# EAGLE design ir-sensor-breakout-mk-2.1 (EAGLE 6.5.0)
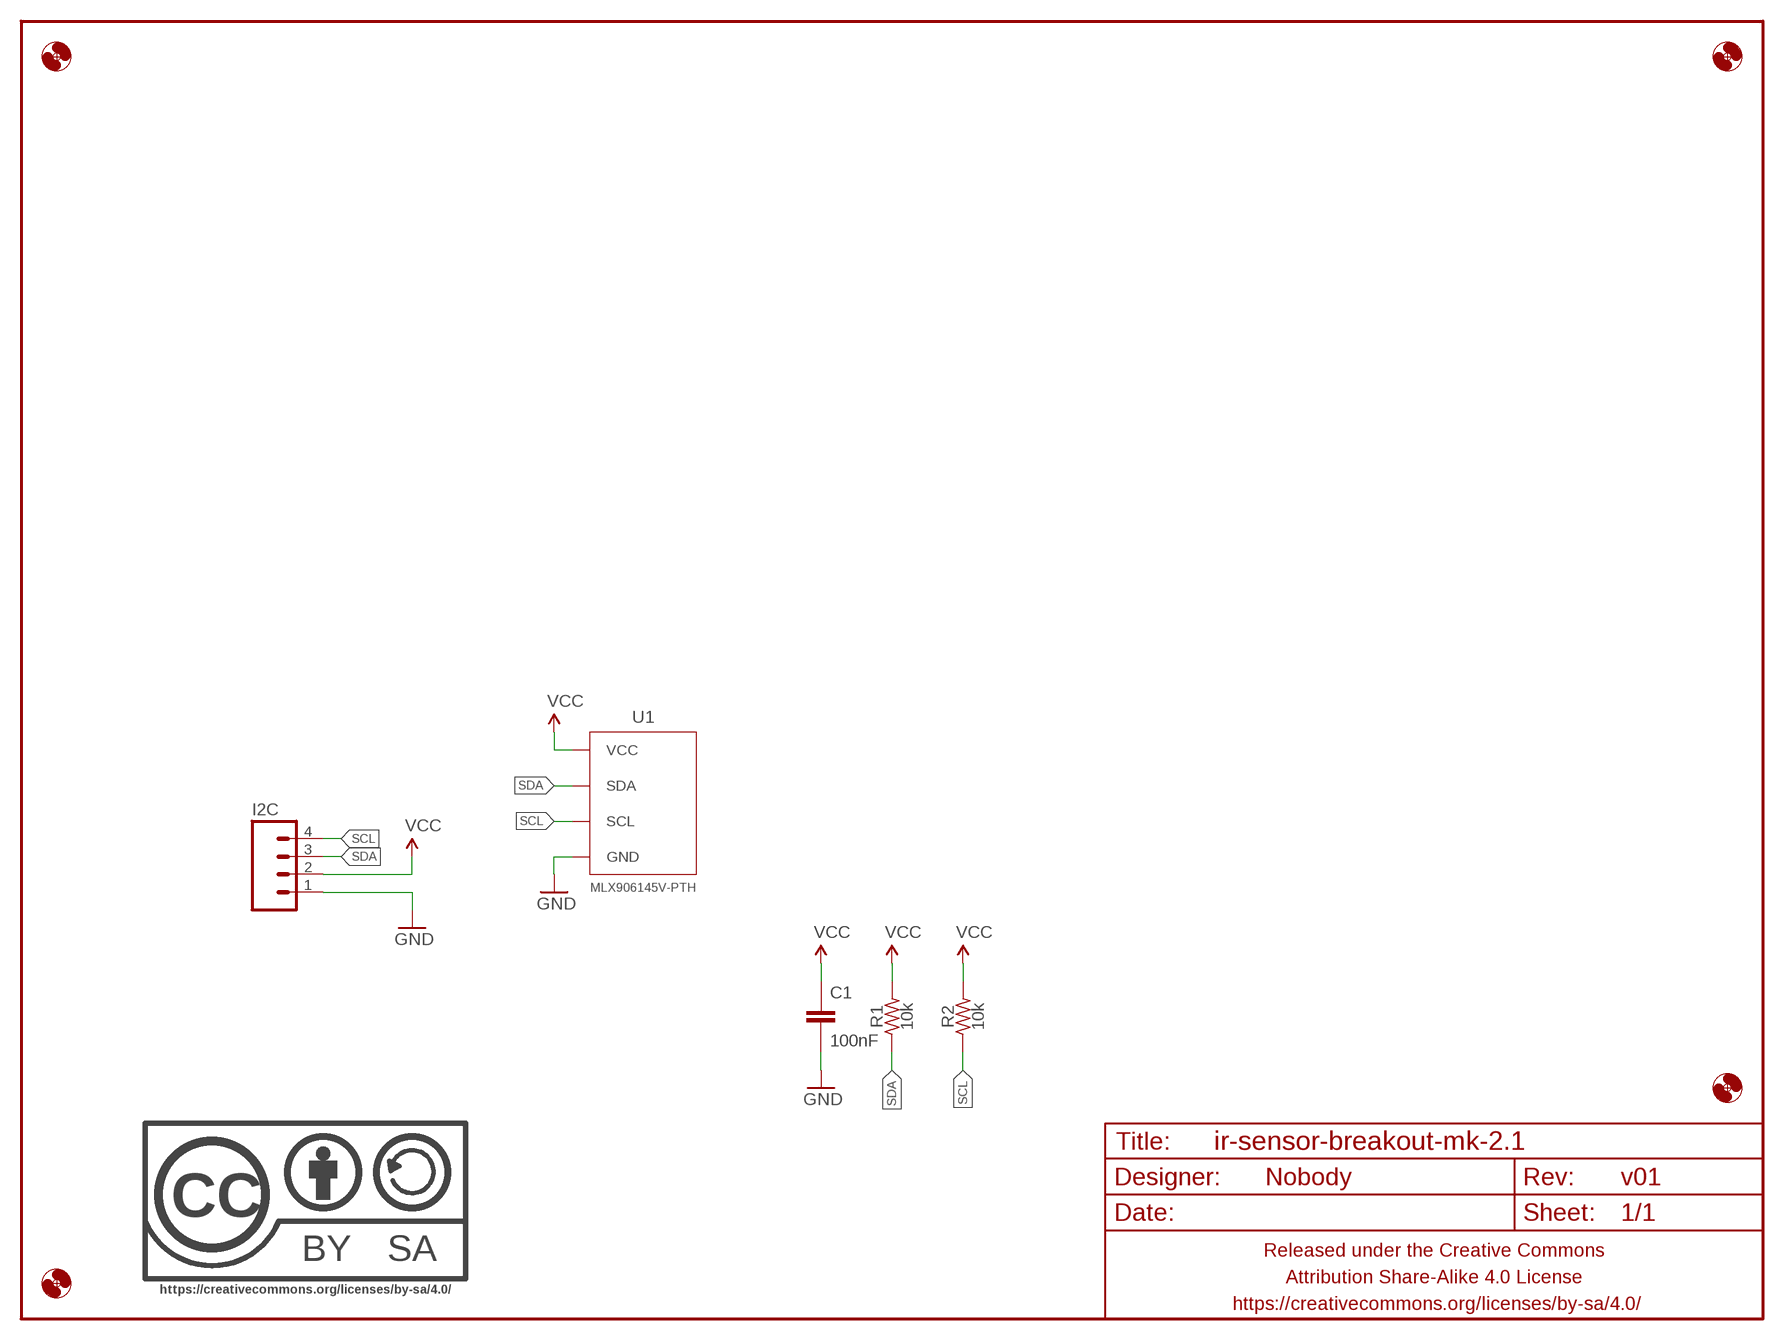
[diagram p0: schematic, sheet 1]

## Parts
C1  100nF  CAPACITOR-CERAMICC0805  [C0805]
FRAME1  FRAME-LETTERNO_PACKAGE  [DUMMY]
H1  HOLE#2  [HOLE-#2]
H2  HOLE#2  [HOLE-#2]
H3  HOLE#2  [HOLE-#2]
H4  HOLE#2  [HOLE-#2]
I2C  M04JST-PTH-VERT  [JST-4-PH-VERT-PTH]
R1  10k  RESISTORR0805  [R0805]
R2  10k  RESISTORR0805  [R0805]
U1  MLX906145V-PTH  [TO-39-4]
U$1  CC-BY-SA-4.0NO-URL  [CC-BY-SA-4.0-NO-URL]

## Nets
GND: C1.2 I2C.1 U1.4(GND)
SCL: I2C.4 R2.1 U1.1(SCL)
SDA: I2C.3 R1.1 U1.2(SDA)
VCC: C1.1 I2C.2 R1.2 R2.2 U1.3(VCC)

## Library data of the parts
C1 = A_butts:CAPACITOR-CERAMIC: CAPACITOR, European symbol
FRAME1 = A_butts:FRAME-LETTER: Schematic Frame Standard 8.5x11 US Letter frame; DESIGNER: Nobody; VERSION: v01
H1-H4 = A_butts:HOLE: MOUNTING HOLE with drill center marker
I2C = A_butts:M04: Header 4 Standard 4-pin 0.1" header. Use with straight break away headers (SKU : PRT-00116), right angle break away headers (PRT-00553), swiss pins (PRT-00743), machine pins (PRT-00117), and female headers (PRT-00115). Molex polarized connector foot print use with SKU : PRT-08231 with associated crimp pins and housings. 1MM SMD Version SKU: PRT-10208
R1 R2 = A_butts:RESISTOR: RESISTOR, American symbol
U1 = A_butts:MLX90614
U$1 = A_butts:CC-BY-SA-4.0

## Board
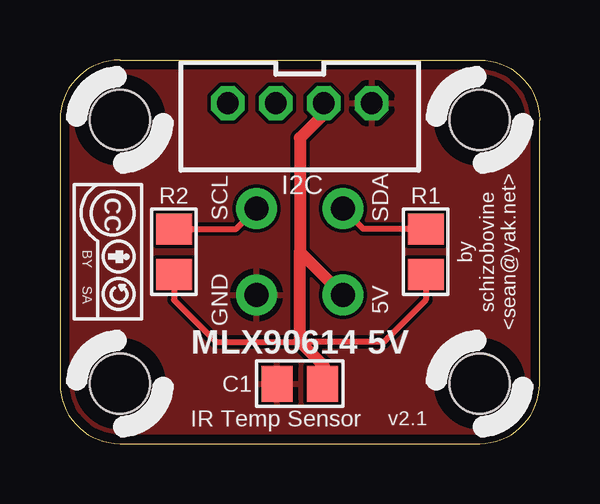
[diagram p1: board, top side]
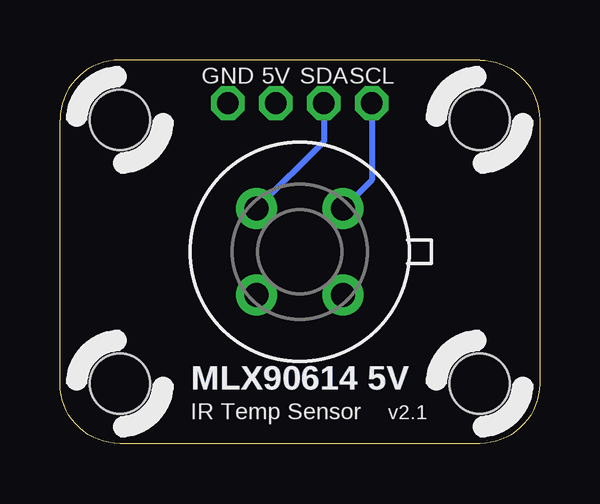
[diagram p2: board, bottom side, seen from below]

Size 20 x 16 mm. Coordinates in mm from the lower left corner, seen from the top.
Outline: 2.5,16 17.5,16 arc-90 20,13.5 20,2.5 arc-90 17.5,0 2.5,0 arc-90 0,2.5 0,13.5 arc-90 2.5,16
Copper layers (1*16): Top 0.0356mm / dielectric 1.5011mm / Bottom 0.0356mm
Design rules "LaenPCBOrder_2": minimum track width 6mil, minimum drill 13mil, track to track 6mil, track to pad 6mil, pad to pad 6mil, via to via 6mil, smd to smd 6mil, copper to edge 15mil, drill to drill 6mil, minimum pad ring 7mil, minimum via ring 7mil, stop-mask expansion 3mil, vias tented up to drill 20mil, thermal gap 10mil

### Footprints (pad centres in the part's own frame; a part is rotated, then mirrored left to right if it is on the bottom)
C0805 = smd 1.3 x 1.5: 1 -0.95,0; 2 0.95,0
HOLE-#2 = hole 2.5: 0,0
JST-4-PH-VERT-PTH = drill 0.9 pad 1.4 octagon: 1 0,0; 2 2,0; 3 4,0; 4 6,0
R0805 = smd 1.3 x 1.5: 1 -0.95,0; 2 0.95,0
TO-39-4 = drill 1 pad 1.7: 1 -1.8,1.8; 2 -1.8,-1.8; 3 1.8,-1.8; 4 1.8,1.8

### Placement (x,y rotation side)
C1  10,2.5 180 top
FRAME1  0,0 0 top
H1  2.5,2.5 0 top
H2  2.5,13.5 0 top
H3  17.5,13.5 0 top
H4  17.5,2.5 0 top
I2C  13,14.2 180 top
R1  15.25,8 270 top
R2  4.75,8 270 top
U1  10,8 270 bottom
U$1  2,8 270 top

### Tracks (layer width: path | path; a pad name or v marks a point on that pad's centre or on a via)
GND
  pour Top: -0.1,-0.1 20.1,-0.1 20.1,16.1 -0.1,16.1
SCL
  Top 0.25: R2.1 7.35,8.95 U1.1
  Bottom 0.25: I2C.4 7,11 U1.1
SDA
  Top 0.25: R1.1 12.65,8.95 U1.2
  Bottom 0.25: I2C.3 9,12.6 U1.2
VCC
  Top 0.25: R2.2 4.75,6 6.5,4.25 10,4.25 13.5,4.25 15.25,6 R1.2
  Top 0.5: I2C.2 11,13.75 10,12.75 10,8 | 10,8 U1.3 | C1.1 11,2.55 11,3.25 10,4.25 10,8

### Text on the board
Bottom: MLX90614 5V
tPlace: SCL | SDA | by / schizobovine / <sean@yak.net> | GND | 5V | MLX90614 5V | IR Temp Sensor
bPlace: SCL | SDA | 5V | GND | MLX90614 5V | IR Temp Sensor